# EAGLE design tubescreamer (EAGLE 6.5.0)
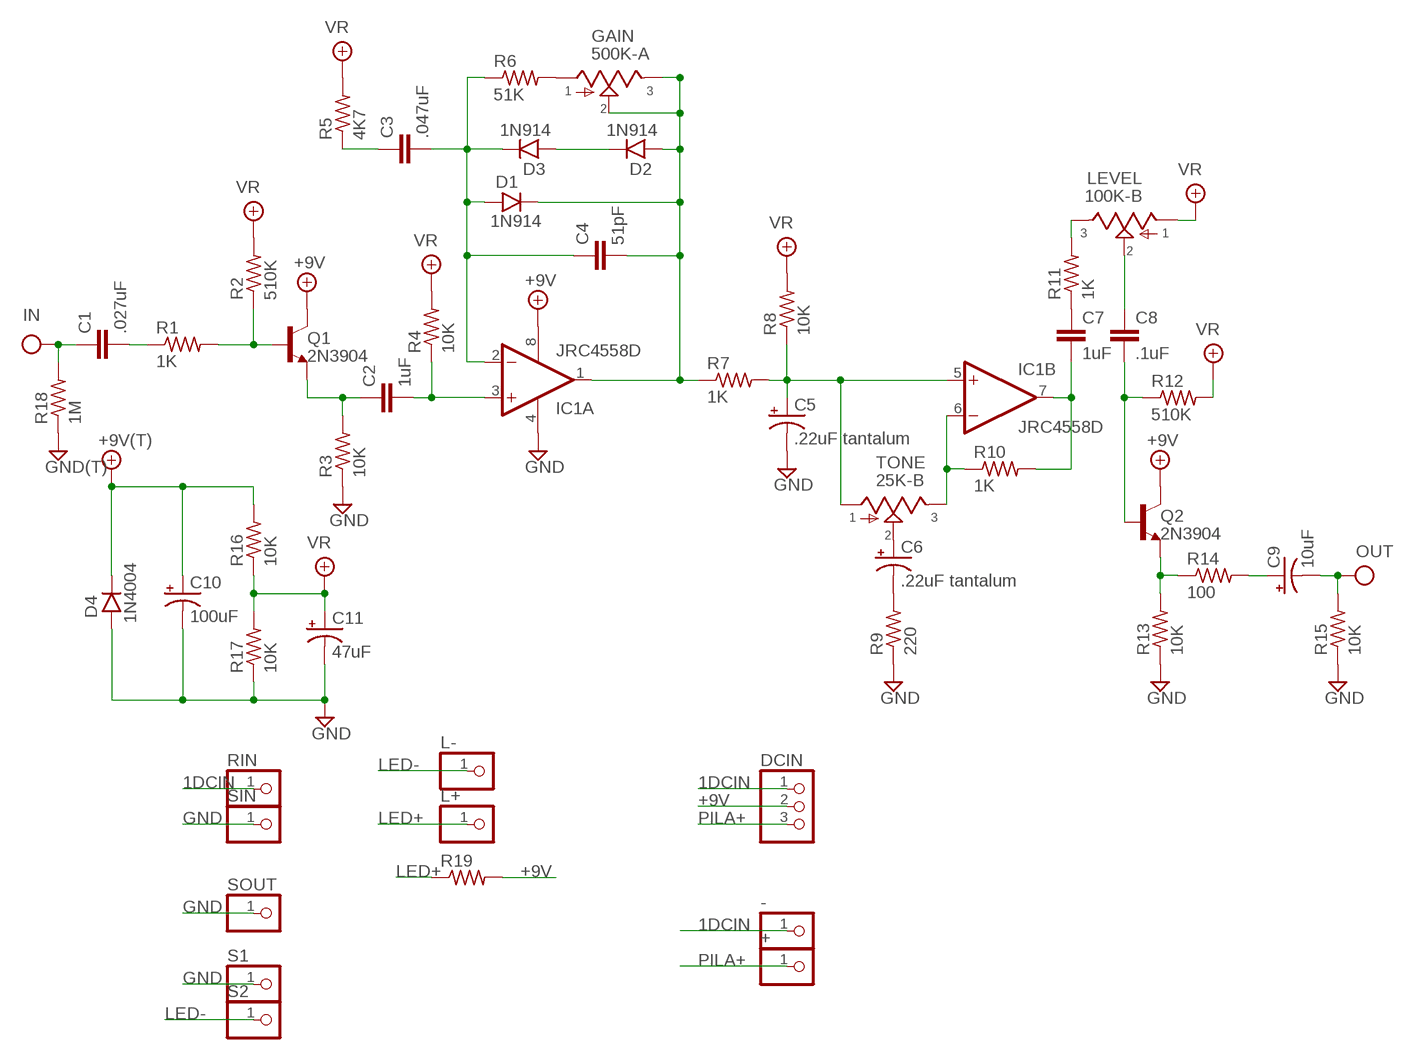
[diagram p0: schematic, sheet 1]

## Parts
+  PINHD-1X1CB  [1X01-CLEANBIG]
+9V  +9V(T)  [PAD]
-  PINHD-1X1CB  [1X01-CLEANBIG]
C1  .027uF  072X0252  [072X025]
C2  1uF  072X0352  [072X035]
C3  .047uF  072X0252  [072X025]
C4  51pF  050X030_0252  [050X030_025_2]
C5  .22uF tantalum  044A2  [044A_2]
C6  .22uF tantalum  044A1  [044A]
C7  1uF  072X0352  [072X035]
C8  .1uF  072X0252  [072X025]
C9  10uF  0501  [050_020_1]
C10  100uF  0631  [063_025]
C11  47uF  0501  [050_020_1]
D1  1N914  1N914.2  [DO35-2]
D2  1N914  1N914.2  [DO35-2]
D3  1N914  1N914.2  [DO35-2]
D4  1N4004  1N400X.3  [DO41-3]
DCIN  PINHD-1X3CB  [1X03-CLEANBIG]
GAIN  500K-A  POT  [POT]
GND  GND(T)  [PAD]
IC1  JRC4558D  LM4558N  [DIL08]
IN  IN(T)  [PAD]
L+  PINHD-1X1CB  [1X01-CLEANBIG]
L-  PINHD-1X1CB  [1X01-CLEANBIG]
LEVEL  100K-B  POT  [POT]
OUT  OUT(T)  [PAD]
Q1  2N3904  [TO92-]
Q2  2N3904  [TO92-]
R1  1K  6MM.1  [R0207/1V]
R2  510K  6MM.1  [R0207/1V]
R3  10K  6MM.1  [R0207/1V]
R4  10K  6MM.1  [R0207/1V]
R5  4K7  6MM.1  [R0207/1V]
R6  51K  6MM.1  [R0207/1V]
R7  1K  6MM.1  [R0207/1V]
R8  10K  6MM.1  [R0207/1V]
R9  220  6MM.1  [R0207/1V]
R10  1K  6MM.1  [R0207/1V]
R11  1K  6MM.1  [R0207/1V]
R12  510K  6MM.1  [R0207/1V]
R13  10K  6MM.1  [R0207/1V]
R14  100  6MM.1  [R0207/1V]
R15  10K  6MM.1  [R0207/1V]
R16  10K  6MM.1  [R0207/1V]
R17  10K  6MM.1  [R0207/1V]
R18  1M  6MM.1  [R0207/1V]
R19  6MM.1  [R0207/1V]
RIN  PINHD-1X1CB  [1X01-CLEANBIG]
S1  PINHD-1X1CB  [1X01-CLEANBIG]
S2  PINHD-1X1CB  [1X01-CLEANBIG]
SIN  PINHD-1X1CB  [1X01-CLEANBIG]
SOUT  PINHD-1X1CB  [1X01-CLEANBIG]
TONE  25K-B  POT  [POT]

## Nets
1DCIN: -.1 DCIN.1 RIN.1
+9V: +9V.1(+9V) C10.+ D4.C DCIN.2 IC1.8(P:V+) Q1.1(C) Q2.1(C) R16.2 R19.2
GND: C5.2(-) C10.- C11.- D4.A GND.1(GND) IC1.4(P:V-) R3.1 R9.1 R13.1 R15.1 R17.1 R18.1 S1.1 SIN.1 SOUT.1
IN: C1.1 IN.1(IN) R18.2
LED+: L+.1 R19.1
LED-: L-.1 S2.1
N$1: GAIN.1 R6.2
N$2: C1.2 R1.1
N$3: Q1.2(B) R1.2 R2.1
N$4: C2.2 IC1.3(A:+IN) R4.1
N$5: C3.2 C4.1 D1.A D3.C IC1.2(A:-IN) R6.1
N$6: C2.1 Q1.3(E) R3.2
N$7: C4.2 D1.C D2.A GAIN.2 GAIN.3 IC1.1(A:OUT) R7.1
N$8: C6.1(+) TONE.2
N$9: C5.1(+) IC1.5(B:+IN) R7.2 R8.1 TONE.1
N$10: IC1.6(B:-IN) R10.1 TONE.3
N$11: C3.1 R5.1
N$12: C6.2(-) R9.2
N$13: C7.1 R11.1
N$14: C7.2 IC1.7(B:OUT) R10.2
N$16: LEVEL.3 R11.2
N$17: Q2.3(E) R13.2 R14.1
N$18: C8.1 LEVEL.2
N$19: C8.2 Q2.2(B) R12.1
N$20: C9.+ R14.2
N$22: D2.C D3.A
OUT: C9.- OUT.1(OUT) R15.2
PILA+: +.1 DCIN.3
VR: C11.+ LEVEL.1 R2.2 R4.2 R5.2 R8.2 R12.2 R16.1 R17.2

## Library data of the parts
+ - L+ L- RIN S1 S2 SIN SOUT = adafruit:PINHD-1X1: Pin header 1x1 for 0.1" spacing With round pins
+9V = gm-supply:+9V(T): +9V Voltage Supply use this to hook up +9v throughout a schematic instead of running wire automatically labels the net "+9v" adds a hookup pad to the circuit board
C1 C3 C8 = gm-caps-film-box:072X025: 1000pF - 0.47uF WIMA MKP2 63, 100V: 1000pF - 0.015uF; MKS2 50V: 0.33 - 0.47uF; 63V: 1000pF - 0.22uF;
C2 C7 = gm-caps-film-box:072X035: 0.15 - 1.0uF; WIMA MKP2 63, 100V: 0.047uF; MKS2 50V: 0.68 - 1.0uF; 63V: 0.33 - 0.47uF; 100V: 0.15 - 0.22uF;
C4 = gm-caps-ceramic:050X030_025: 47 - 120pF Xicon Ceramic Disc 2.5mm lead spacing
C5 C6 = gm-caps-tant:044A: .1 - 1.5µF Vishay Sprague Tantalex Long/Short (Case Code A); 4.4mm; 0.1" lead spacing
C9 C11 = gm-caps-electro-pol:050: 0.22 - 100uF Xicon values at Mouser.com: 10V: 10 - 100uF; 16V: 2.2 - 47uF; 25V: 0.47 - 47uF; 50V: 0.22 - 22uF
C10 = gm-caps-electro-pol:063: 33 - 220uF Xicon values at Mouser.com 10V: 220uF; 16V: 100uF; 25V: 100uF; 50V: 33uF
D1-D3 = gm-diodes:1N914: Fast Switching Diode DO-35 glass case a.k.a. 1N4148
D4 = gm-diodes:1N400X: Rectifier Diodes often used in power supply to prevent damage from reverse polarization
DCIN = adafruit:PINHD-1X3: PIN HEADER
GAIN LEVEL TONE = gm-pots:POT: Potentiometers the arrow indicates the clockwise motion of th wiper (lug 2) fully counter clockwise there is no resistance between lugs 1 and 2 fully clockwise the resistance between lugs 1 and 2 is the value of the pot
GND = gm-supply:GND(T): Ground use this to hook up ground (GND) throughout a schematic instead of running wire automatically labels the net "GND" adds a hookup pad to the circuit board (you can use several)
IC1 = gm-ics:*4558: *4558 Op Amp Infamous for its use in tube screamers. This op amp has many manufacturers, hence the leading "*" in the name. The JRC4558 is a widely used example.
IN = gm-supply:IN(T): Input shematic input label with circuit board terminal/pad generally used only once on a schematic (because this device labels the net "IN" in the same way as a voltage supply or ground net)
OUT = gm-supply:OUT(T): Output output label with circuit board terminal/pad usually appears only once on a schematic
Q1 Q2 = gm-trans:2N3904: NPN Transistor
R1-R19 = gm-resistors:6MM: 6mm Resistors Leads spaced 1-6 holes apart for 0.1" perfboard. Suitable for 1/4 watt resistors.

## Net classes
0 default: width 0.406 mm

## Board
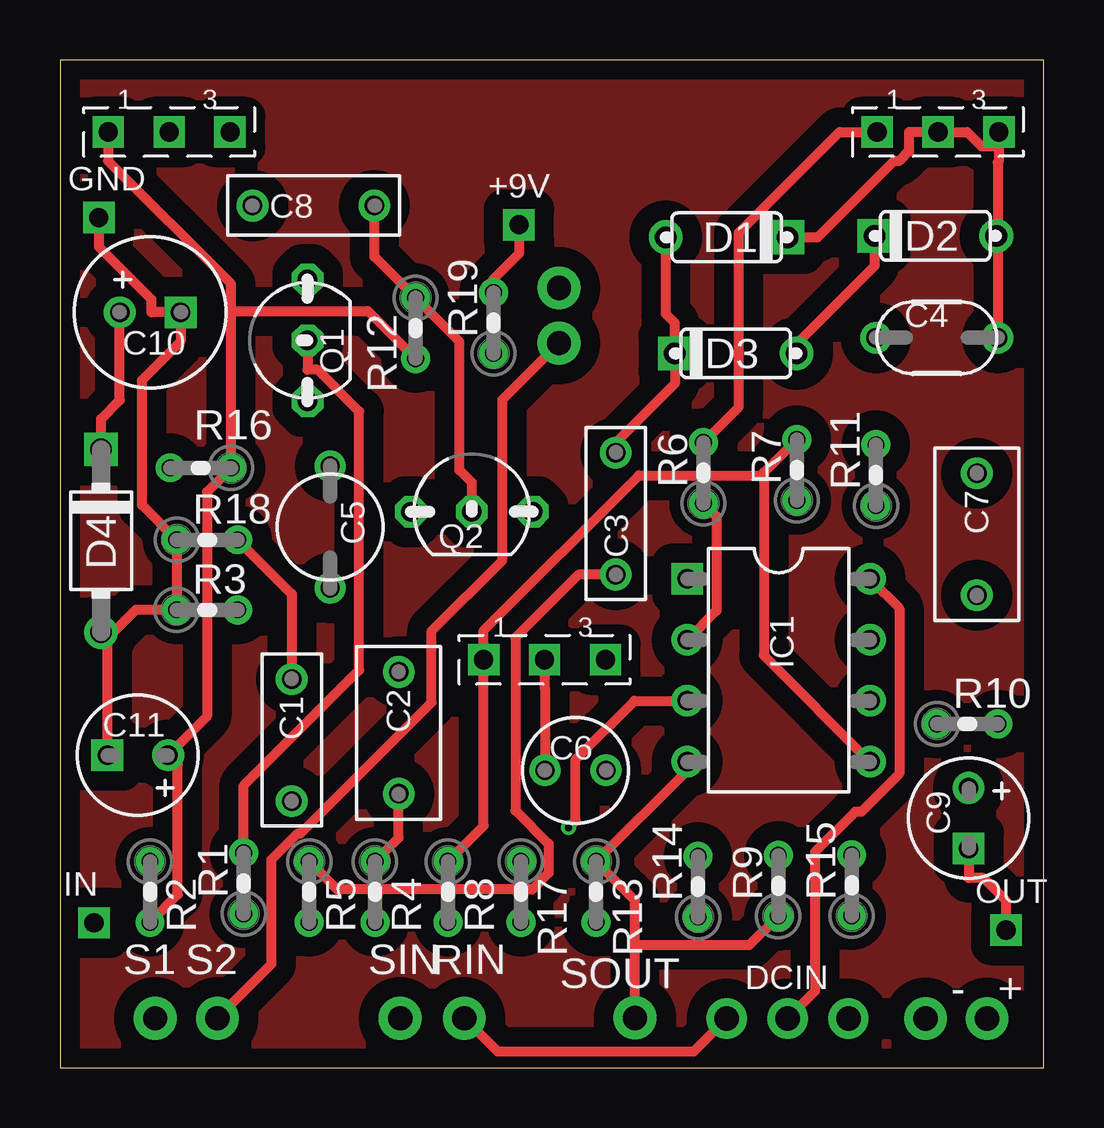
[diagram p1: board, top side]
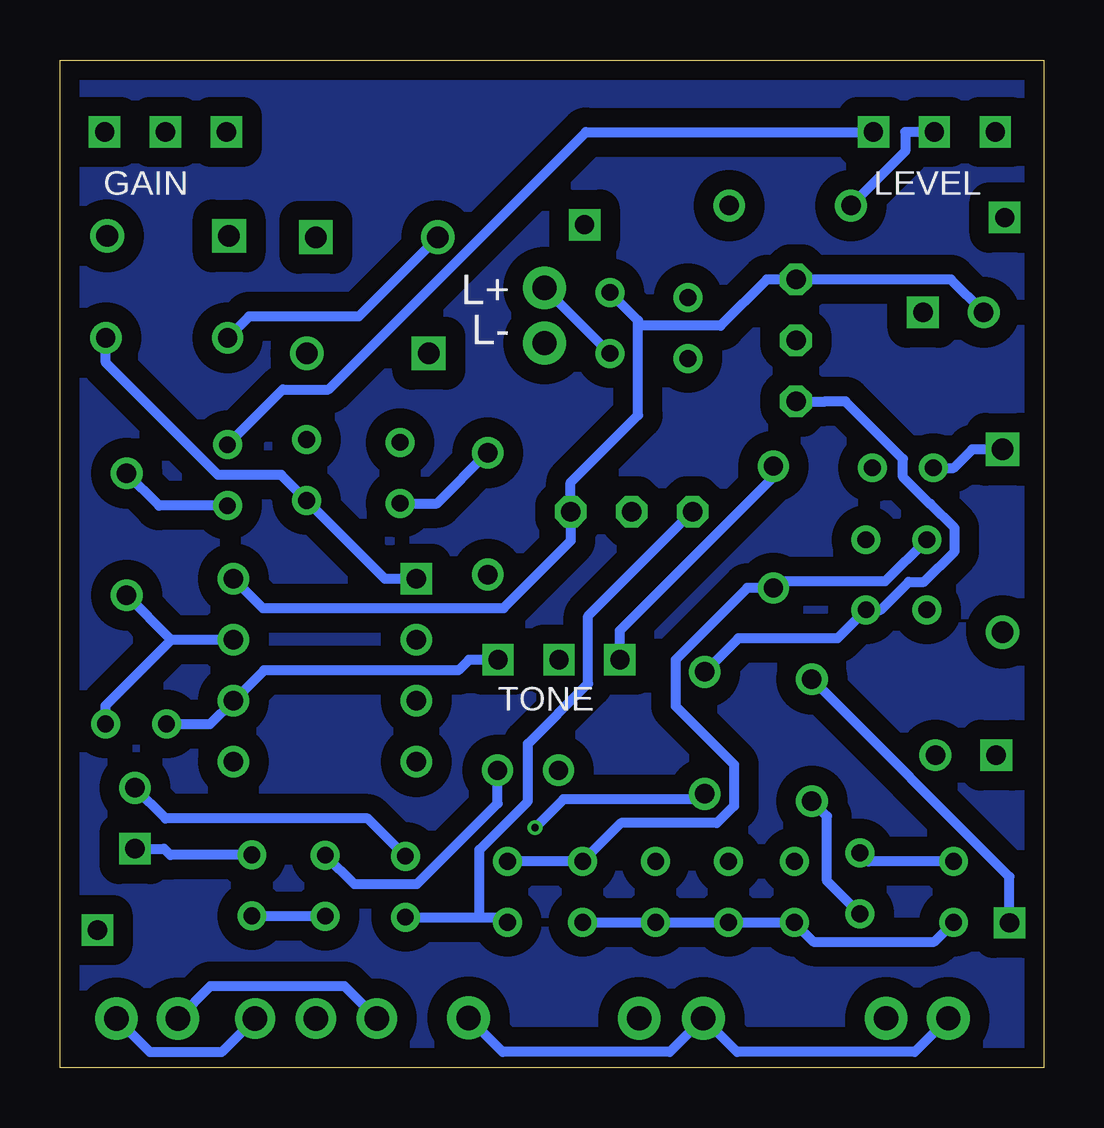
[diagram p2: board, bottom side, seen from below]

Size 41 x 42 mm. Coordinates in mm from the lower left corner, seen from the top.
Outline: 0,0 41,0 41,42 0,42 0,0
Copper layers (1*16): Top 0.035mm / dielectric 1.5mm / Bottom 0.035mm
Design rules "ITEADstudio_DRC": minimum track width 6mil, minimum drill 12mil, track to track 6mil, track to pad 6mil, pad to pad 6mil, via to via 6mil, smd to smd 0mil, copper to edge 10mil, drill to drill 10mil, minimum pad ring 10mil, minimum via ring 6mil, stop-mask expansion 2mil, vias tented up to drill 100mil, thermal gap 10mil

### Footprints (pad centres in the part's own frame; a part is rotated, then mirrored left to right if it is on the bottom)
1X01-CLEANBIG = drill 1.016 pad 1.778: 1 0,0
PAD = drill 0.8 square: 1 0,0
072X025 = drill 0.813: 1 -2.54,0; 2 2.54,0
072X035 = drill 0.813: 1 -2.54,0; 2 2.54,0
050X030_025_2 = drill 0.8: 1 -2.54,0; 2 2.54,0
044A_2 = drill 0.8: 1 -2.54,0; 2 2.54,0
044A = drill 0.8: 1 -1.27,0; 2 1.27,0
050_020_1 = drill 0.813: + -1.27,0 | drill 0.813 square: - 1.27,0
063_025 = drill 0.813: + -1.27,0 | drill 0.813 square: - 1.27,0
DO35-2 = drill 0.9: A 2.54,0 | drill 0.9 square: C -2.54,0
DO41-3 = drill 0.9: A 3.81,0 | drill 0.9 square: C -3.81,0
1X03-CLEANBIG = drill 1.016 pad 1.676: 1 -2.54,0; 2 0,0; 3 2.54,0
POT = drill 0.8 square: 1 2.54,0; 2 0,0; 3 -2.54,0
DIL08 = drill 0.813 square: 1 -3.81,-3.81 | drill 0.813: 2 -1.27,-3.81; 3 1.27,-3.81; 4 3.81,-3.81; 5 3.81,3.81; 6 1.27,3.81; 7 -1.27,3.81; 8 -3.81,3.81
TO92- = drill 0.813 octagon: 1 2.54,0; 2 0,0; 3 -2.54,0
R0207/1V = drill 0.7: 1 -1.27,0; 2 1.27,0

### Placement (x,y rotation side)
+  38.64,2.04 0 top
+9V  19.13,35.13 0 top
-  36.08,2.04 0 top
C1  9.66,13.65 270 top
C2  14.12,13.95 270 top
C3  23.17,23.09 90 top
C4  36.55,30.42 0 top
C5  11.26,22.53 270 top
C6  21.49,12.39 0 top
C7  38.22,22.23 270 top
C8  10.57,35.93 0 top
C9  37.88,10.39 270 top
C10  3.76,31.48 0 top
C11  3.24,13.02 180 top
D1  27.79,34.61 180 top
D2  36.49,34.67 0 top
D3  28.17,29.77 0 top
D4  1.71,21.96 270 top
DCIN  30.33,2.04 0 top
GAIN  36.6,39 180 top
GND  1.62,35.43 0 top
IC1  29.96,16.56 270 top
IN  1.42,6.03 0 top
L+  20.8,32.5 180 top
L-  20.8,30.2 0 top
LEVEL  4.55,39 180 top
OUT  39.44,5.73 0 top
Q1  10.32,30.31 90 top
Q2  17.17,23.17 0 top
R1  7.66,7.68 90 top
R2  3.75,7.32 270 top
R3  6.13,19.08 0 top
R4  13.13,7.32 270 top
R5  10.39,7.32 270 top
R6  26.82,24.79 90 top
R7  30.72,24.91 90 top
R8  16.17,7.32 270 top
R9  29.94,7.58 90 top
R10  37.83,14.32 0 top
R11  34.02,24.69 90 top
R12  14.82,30.82 270 top
R13  22.35,7.32 270 top
R14  26.6,7.54 90 top
R15  33,7.59 90 top
R16  5.86,25 180 top
R17  19.21,7.32 270 top
R18  6.14,22 0 top
R19  18.07,31.04 90 top
RIN  16.86,2.05 0 top
S1  3.97,2.05 0 top
S2  6.56,2.05 0 top
SIN  14.18,2.05 0 top
SOUT  23.97,2.07 0 top
TONE  20.2,17 180 top

### Tracks (layer width: path | path; a pad name or v marks a point on that pad's centre or on a via)
1DCIN
  Top 0.406: RIN.1 18.24,0.67 26.42,0.67 DCIN.1
  Bottom 0.406: DCIN.1 29.14,3.39 34.73,3.39 -.1
+9V
  Top 0.406: IC1.8 34.99,19.15 34.99,12.24 33.41,10.66 33.15,10.66 31.47,8.98 31.47,3.18 DCIN.2 | D4.C 1.71,27.03 2.49,27.81 C10.+ | +9V.1 19.13,33.92 18.07,32.86 R19.2
  Bottom 0.406: C10.+ 3.86,32.85 Q1.1 11.54,32.85 13.46,30.93 16.9,30.93 | IC1.8 32.55,19.15 22.51,19.15 19.71,21.95 Q2.1 19.71,24.39 16.9,27.2 16.9,30.93 | 16.9,30.93 16.9,31.14 R19.2 | D4.C 2.97,25.77 3.74,25 R16.2
GND
  Top 0.406: IC1.4 26.15,12.39 R13.1 23.97,6.97 23.97,5.11 | 23.97,5.11 28.74,5.11 R9.1 | SOUT.1 23.97,5.11 | GND.1 1.62,34.22 3.81,32.03 3.81,31.48 C10.- 5.03,30.26 3.42,28.65 3.42,23.45 R18.1 R3.1 3.16,19.08 1.97,17.89 | 1.97,17.89 C11.- | D4.A 1.97,17.89
  Bottom 0.406: R9.1 R15.1 | R18.1 6.61,20.26 10.99,20.26 C5.2 12.35,19.99 15.34,16.99 15.34,15.07 12.9,12.63 12.9,10.9 13.62,10.19 17.61,10.19 R17.1 R13.1 | S1.1 5.37,0.65 12.78,0.65 SIN.1 15.58,0.65 22.55,0.65 SOUT.1
IN
  Top 0.406: R18.2 9.66,19.75 C1.1
  Bottom 0.406: IN.1 1.42,7.95 C1.1
LED+
  Bottom 0.406: R19.1 L+.1
LED-
  Top 0.406: S2.1 8.82,4.31 8.82,8.67 9.91,9.75 10.03,9.75 15.5,15.22 15.5,18.2 18.44,21.14 18.44,27.84 L-.1
N$1
  Top 0.406: R6.2 28.3,27.54 28.3,34.81 32.49,39 GAIN.1
N$2
  Bottom 0.406: R1.1 9.03,7.78 9.03,10.47 C1.2
N$3
  Top 0.406: Q1.2 10.32,29.09 10.73,29.09 12.48,27.35 12.48,16.57 7.66,11.75 R1.2
  Bottom 0.406: R2.1 7.3,8.59 R1.2
N$4  (via drill 0.3 pad 0.61)
  Top 0.406: v21.2,10 21.49,10.29 21.49,12.84 23.94,15.29 IC1.3 | R4.1 14.12,9.58 C2.2
  Bottom 0.406: C2.2 14.35,11.18 20.02,11.18 v21.2,10
N$5
  Top 0.406: R6.1 27.37,22.97 27.37,19.05 IC1.2 | C3.2 23.17,26.05 25.63,28.51 D3.C 25.63,30.4 25.63,31.03 25.25,31.41 D1.A
  Bottom 0.406: R6.1 25.28,23.52 C3.2 | D1.A 28.55,31.31 33.12,31.31 C4.1
N$6
  Bottom 0.406: C2.1 12.72,17.89 8.59,17.89 R3.2 6.78,19.08 5.62,20.24 4.98,20.24 3.7,21.52 3.7,22.49 4.72,23.5 4.74,23.5 5.86,24.62 5.86,25.37 8.26,27.77 9.1,27.77 Q1.3
N$7
  Top 0.406: 39.14,38.39 38.42,38.39 37.81,39 GAIN.2 35.39,39 35.39,38.2 34.98,37.79 34.77,37.79 31.59,34.61 D1.C | 39.14,38.39 39.14,37.79 39.09,37.74 39.09,34.67 | GAIN.3 39.14,38.39 | 39.09,34.67 C4.2 | D2.A 39.09,34.67
  Bottom 0.406: C4.2 39.09,29.38 34.41,24.7 31.78,24.7 R7.1 27.45,20.37 IC1.1
N$8
  Top 0.406: TONE.2 20.2,15.79 20.22,15.77 C6.1
N$9
  Top 0.406: 29.34,24.68 29.34,17.18 IC1.5 | R7.2 29.34,24.8 29.34,24.68 | 29.34,24.68 24.13,24.68 17.66,18.21 TONE.1 17.66,10.08 R8.1
  Bottom 0.406: TONE.1 17.66,18.21 11.26,24.61 C5.1
N$10
  Bottom 0.406: TONE.3 23.95,17 24.39,16.56 32.5,16.56 IC1.6 34.74,14.32 R10.1
N$11
  Top 0.406: C3.1 21.62,20.55 18.99,17.92 18.99,10.72 20.37,9.33 20.37,8.11 19.69,7.42 11.55,7.42 R5.1
N$12
  Bottom 0.406: R9.2 28.74,7.65 26.12,7.65 22.76,11.01 C6.2
N$13
  Bottom 0.406: R11.1 36.87,23.42 C7.1
N$14
  Bottom 0.406: 36.36,17.83 C7.2 | IC1.7 36.36,17.83 | R10.2 39.1,15.09 36.36,17.83
N$15
  pour Top (isolate 0.813): 0,42 41.1,42 41.1,-0.3 0,-0.3
N$16
  Bottom 0.406: R11.2 31.71,28.27 29.8,28.27 19.07,39 LEVEL.3
N$17
  Bottom 0.406: 23.51,6.27 22.57,6.27 R13.2 | R14.1 23.51,6.27 | 23.51,6.27 23.51,9.08 21.49,11.1 21.49,13.5 18.99,16 18.99,18.81 Q2.3
N$18
  Bottom 0.406: LEVEL.2 5.76,39 5.76,38.2 C8.1
N$19
  Top 0.406: Q2.2 17.17,24.39 16.65,24.91 16.65,30.26 R12.1 13.11,33.8 C8.2
N$20
  Bottom 0.406: R14.2 28.17,10.38 36.6,10.38 C9.+
N$21
  pour Bottom (isolate 0.813): 0,42 40.8,42 40.8,-0.3 0,0
N$22
  Top 0.406: D2.C 33.95,33.41 30.71,30.17 D3.A
OUT
  Top 0.406: C9.- 37.88,7.9 38.48,7.9 39.44,6.94 OUT.1
  Bottom 0.406: C9.- 36.66,9.12 36.4,8.86 R15.2
PILA+
  Bottom 0.406: DCIN.3 34.27,0.64 37.24,0.64 +.1
VR
  Top 0.406: 7.13,31.53 7.13,32.67 2.01,37.79 LEVEL.1 | 7.13,31.53 R16.1 6.13,24 6.13,14.64 C11.+ 4.91,12.62 4.91,7.21 R2.2 | 7.13,31.53 12.84,31.53 R12.2
  Bottom 0.406: R2.2 4.55,5.25 9.59,5.25 R5.2 R4.2 R8.2 R17.2

### Text on the board
tTest: TSv1.0 | PILA | 1 | 3
bTest: TubeScreamer